# EAGLE schematic MIU60_REVE (EAGLE 6.5.0)
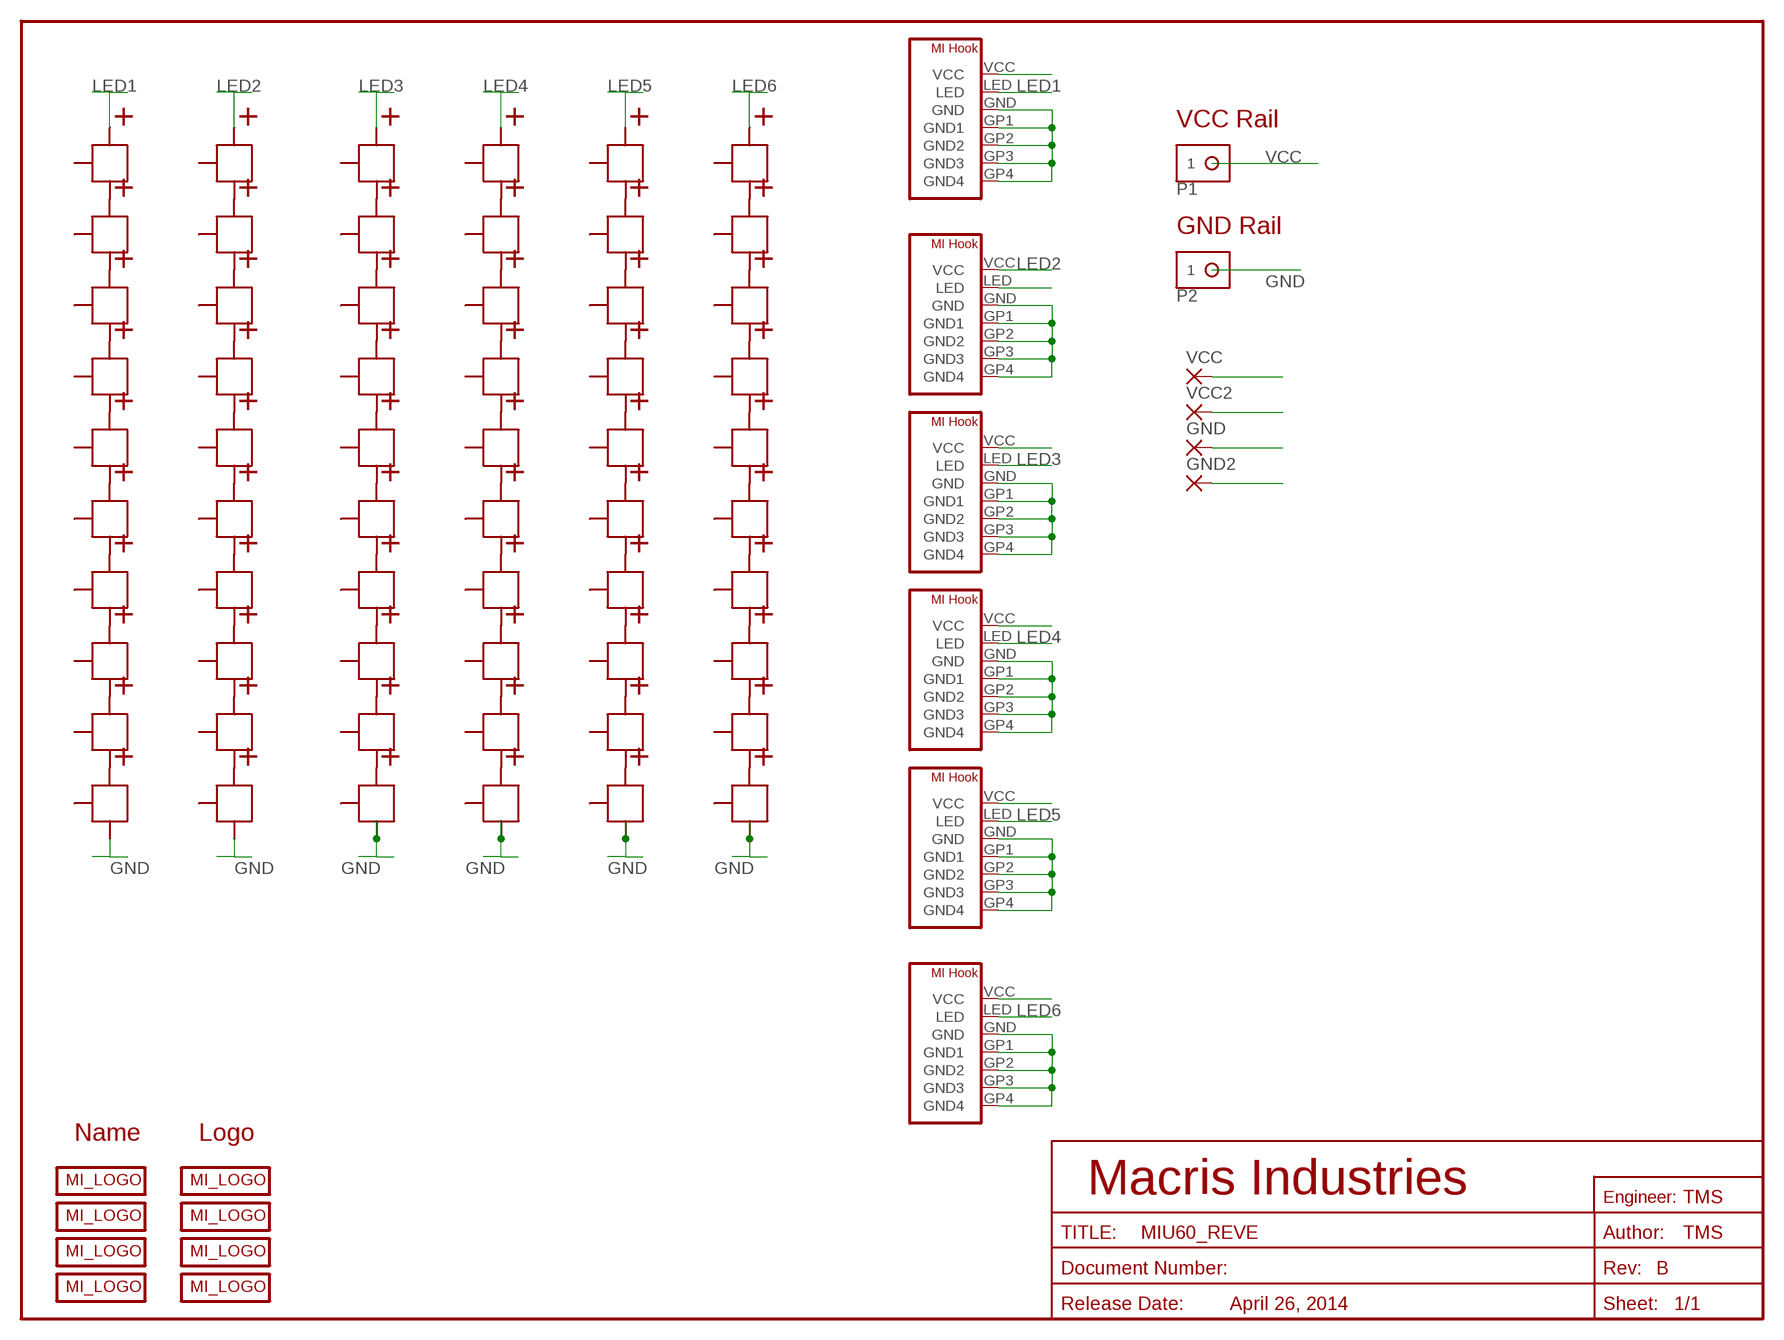
[diagram p0: schematic, sheet 1]

## Parts
GND  SMD5  [SMD2,54-5,08]
GND2  SMD5  [SMD2,54-5,08]
P1  PAD-10G  [PAD_10G]
P2  PAD-10G  [PAD_10G]
U$1  MI_LOGO-50MIL  MI_LOGO-NAME_TWO  [MI_LOGO_NAME_2]
U$2  MI_LOGO-2014_USA  [MACRIS_USA_LOGO]
U$3  MI_LOGO-50MIL  MI_LOGO-NAME_TWO  [MI_LOGO_NAME_2]
U$4  MI_LOGO-2014_USA  [MACRIS_USA_LOGO]
U$5  MI_LOGO-50MIL  MI_LOGO-NAME_TWO  [MI_LOGO_NAME_2]
U$6  MI_LOGO-50MIL  MI_LOGO-NAME_TWO  [MI_LOGO_NAME_2]
U$7  MI_LOGO-2014_USA  [MACRIS_USA_LOGO]
U$8  MI_LOGO-2014_USA  [MACRIS_USA_LOGO]
U$9  MI_DRIVER_HOOKUP  [MI_DRIVE_HOOKUP]
U$10  MI_DRIVER_HOOKUP  [MI_DRIVE_HOOKUP]
U$11  MI_DRIVER_HOOKUP  [MI_DRIVE_HOOKUP]
U$12  MI_DRIVER_HOOKUP  [MI_DRIVE_HOOKUP]
U$13  MI_DRIVER_HOOKUP  [MI_DRIVE_HOOKUP]
U$14  MI_DRIVER_HOOKUP  [MI_DRIVE_HOOKUP]
U$16  CREE_XP  [XP]
U$17  CREE_XP  [XP]
U$18  CREE_XP  [XP]
U$19  CREE_XP  [XP]
U$20  CREE_XP  [XP]
U$21  CREE_XP  [XP]
U$22  CREE_XP  [XP]
U$23  CREE_XP  [XP]
U$24  CREE_XP  [XP]
U$25  CREE_XP  [XP]
U$26  CREE_XP  [XP]
U$27  CREE_XP  [XP]
U$28  CREE_XP  [XP]
U$29  CREE_XP  [XP]
U$30  CREE_XP  [XP]
U$31  CREE_XP  [XP]
U$32  CREE_XP  [XP]
U$33  CREE_XP  [XP]
U$34  CREE_XP  [XP]
U$35  CREE_XP  [XP]
U$36  CREE_XP  [XP]
U$37  CREE_XP  [XP]
U$38  CREE_XP  [XP]
U$39  CREE_XP  [XP]
U$40  CREE_XP  [XP]
U$41  CREE_XP  [XP]
U$42  CREE_XP  [XP]
U$43  CREE_XP  [XP]
U$44  CREE_XP  [XP]
U$45  CREE_XP  [XP]
U$46  CREE_XP  [XP]
U$47  CREE_XP  [XP]
U$48  CREE_XP  [XP]
U$49  CREE_XP  [XP]
U$50  CREE_XP  [XP]
U$51  CREE_XP  [XP]
U$52  CREE_XP  [XP]
U$53  CREE_XP  [XP]
U$54  CREE_XP  [XP]
U$55  CREE_XP  [XP]
U$56  CREE_XP  [XP]
U$57  CREE_XP  [XP]
U$58  CREE_XP  [XP]
U$59  CREE_XP  [XP]
U$60  CREE_XP  [XP]
U$61  CREE_XP  [XP]
U$62  CREE_XP  [XP]
U$63  CREE_XP  [XP]
U$64  CREE_XP  [XP]
U$65  CREE_XP  [XP]
U$66  CREE_XP  [XP]
U$67  CREE_XP  [XP]
U$68  CREE_XP  [XP]
U$69  CREE_XP  [XP]
U$70  CREE_XP  [XP]
U$71  CREE_XP  [XP]
U$72  CREE_XP  [XP]
U$73  CREE_XP  [XP]
U$74  CREE_XP  [XP]
U$75  CREE_XP  [XP]
VCC  SMD5  [SMD2,54-5,08]
VCC2  SMD5  [SMD2,54-5,08]

## Nets
GND: GND2.1(P) GND.1(P) P2.1 U$9.GND U$9.GP1(GND1) U$9.GP2(GND2) U$9.GP3(GND3) U$9.GP4(GND4) U$10.GND U$10.GP1(GND1) U$10.GP2(GND2) U$10.GP3(GND3) U$10.GP4(GND4) U$11.GND U$11.GP1(GND1) U$11.GP2(GND2) U$11.GP3(GND3) U$11.GP4(GND4) U$12.GND U$12.GP1(GND1) U$12.GP2(GND2) U$12.GP3(GND3) U$12.GP4(GND4) U$13.GND U$13.GP1(GND1) U$13.GP2(GND2) U$13.GP3(GND3) U$13.GP4(GND4) U$14.GND U$14.GP1(GND1) U$14.GP2(GND2) U$14.GP3(GND3) U$14.GP4(GND4) U$25.NEGATIVE U$25.NEGATIVE1(NEGATIVE) U$35.NEGATIVE U$35.NEGATIVE1(NEGATIVE) U$45.NEGATIVE U$45.NEGATIVE1(NEGATIVE) U$55.NEGATIVE U$55.NEGATIVE1(NEGATIVE) U$65.NEGATIVE U$65.NEGATIVE1(NEGATIVE) U$75.NEGATIVE U$75.NEGATIVE1(NEGATIVE)
LED1: U$9.LED U$16.POSITIVE U$16.POSITIVE1(POSITIVE)
LED2: U$10.LED U$26.POSITIVE U$26.POSITIVE1(POSITIVE)
LED3: U$11.LED U$36.POSITIVE U$36.POSITIVE1(POSITIVE)
LED4: U$12.LED U$46.POSITIVE U$46.POSITIVE1(POSITIVE)
LED5: U$13.LED U$56.POSITIVE U$56.POSITIVE1(POSITIVE)
LED6: U$14.LED U$66.POSITIVE U$66.POSITIVE1(POSITIVE)
N$1: U$16.NEGATIVE U$16.NEGATIVE1(NEGATIVE) U$17.POSITIVE U$17.POSITIVE1(POSITIVE)
N$2: U$17.NEGATIVE U$17.NEGATIVE1(NEGATIVE) U$18.POSITIVE U$18.POSITIVE1(POSITIVE)
N$3: U$18.NEGATIVE U$18.NEGATIVE1(NEGATIVE) U$19.POSITIVE U$19.POSITIVE1(POSITIVE)
N$4: U$19.NEGATIVE U$19.NEGATIVE1(NEGATIVE) U$20.POSITIVE U$20.POSITIVE1(POSITIVE)
N$5: U$20.NEGATIVE U$20.NEGATIVE1(NEGATIVE) U$21.POSITIVE U$21.POSITIVE1(POSITIVE)
N$6: U$21.NEGATIVE U$21.NEGATIVE1(NEGATIVE) U$22.POSITIVE U$22.POSITIVE1(POSITIVE)
N$7: U$22.NEGATIVE U$22.NEGATIVE1(NEGATIVE) U$23.POSITIVE U$23.POSITIVE1(POSITIVE)
N$8: U$23.NEGATIVE U$23.NEGATIVE1(NEGATIVE) U$24.POSITIVE U$24.POSITIVE1(POSITIVE)
N$9: U$24.NEGATIVE U$24.NEGATIVE1(NEGATIVE) U$25.POSITIVE U$25.POSITIVE1(POSITIVE)
N$10: U$56.NEGATIVE U$56.NEGATIVE1(NEGATIVE) U$57.POSITIVE U$57.POSITIVE1(POSITIVE)
N$11: U$57.NEGATIVE U$57.NEGATIVE1(NEGATIVE) U$58.POSITIVE U$58.POSITIVE1(POSITIVE)
N$12: U$26.NEGATIVE U$26.NEGATIVE1(NEGATIVE) U$27.POSITIVE U$27.POSITIVE1(POSITIVE)
N$13: U$27.NEGATIVE U$27.NEGATIVE1(NEGATIVE) U$28.POSITIVE U$28.POSITIVE1(POSITIVE)
N$14: U$28.NEGATIVE U$28.NEGATIVE1(NEGATIVE) U$29.POSITIVE U$29.POSITIVE1(POSITIVE)
N$15: U$29.NEGATIVE U$29.NEGATIVE1(NEGATIVE) U$30.POSITIVE U$30.POSITIVE1(POSITIVE)
N$16: U$30.NEGATIVE U$30.NEGATIVE1(NEGATIVE) U$31.POSITIVE U$31.POSITIVE1(POSITIVE)
N$17: U$32.NEGATIVE U$32.NEGATIVE1(NEGATIVE) U$33.POSITIVE U$33.POSITIVE1(POSITIVE)
N$18: U$33.NEGATIVE U$33.NEGATIVE1(NEGATIVE) U$34.POSITIVE U$34.POSITIVE1(POSITIVE)
N$19: U$34.NEGATIVE U$34.NEGATIVE1(NEGATIVE) U$35.POSITIVE U$35.POSITIVE1(POSITIVE)
N$20: U$31.NEGATIVE U$31.NEGATIVE1(NEGATIVE) U$32.POSITIVE U$32.POSITIVE1(POSITIVE)
N$21: U$66.NEGATIVE U$66.NEGATIVE1(NEGATIVE) U$67.POSITIVE U$67.POSITIVE1(POSITIVE)
N$24: U$36.NEGATIVE U$36.NEGATIVE1(NEGATIVE) U$37.POSITIVE U$37.POSITIVE1(POSITIVE)
N$25: U$37.NEGATIVE U$37.NEGATIVE1(NEGATIVE) U$38.POSITIVE U$38.POSITIVE1(POSITIVE)
N$26: U$38.NEGATIVE U$38.NEGATIVE1(NEGATIVE) U$39.POSITIVE U$39.POSITIVE1(POSITIVE)
N$27: U$39.NEGATIVE U$39.NEGATIVE1(NEGATIVE) U$40.POSITIVE U$40.POSITIVE1(POSITIVE)
N$28: U$40.NEGATIVE U$40.NEGATIVE1(NEGATIVE) U$41.POSITIVE U$41.POSITIVE1(POSITIVE)
N$29: U$41.NEGATIVE U$41.NEGATIVE1(NEGATIVE) U$42.POSITIVE U$42.POSITIVE1(POSITIVE)
N$30: U$42.NEGATIVE U$42.NEGATIVE1(NEGATIVE) U$43.POSITIVE U$43.POSITIVE1(POSITIVE)
N$31: U$43.NEGATIVE U$43.NEGATIVE1(NEGATIVE) U$44.POSITIVE U$44.POSITIVE1(POSITIVE)
N$32: U$44.NEGATIVE U$44.NEGATIVE1(NEGATIVE) U$45.POSITIVE U$45.POSITIVE1(POSITIVE)
N$33: U$58.NEGATIVE U$58.NEGATIVE1(NEGATIVE) U$59.POSITIVE U$59.POSITIVE1(POSITIVE)
N$34: U$59.NEGATIVE U$59.NEGATIVE1(NEGATIVE) U$60.POSITIVE U$60.POSITIVE1(POSITIVE)
N$35: U$67.NEGATIVE U$67.NEGATIVE1(NEGATIVE) U$68.POSITIVE U$68.POSITIVE1(POSITIVE)
N$36: U$46.NEGATIVE U$46.NEGATIVE1(NEGATIVE) U$47.POSITIVE U$47.POSITIVE1(POSITIVE)
N$37: U$47.NEGATIVE U$47.NEGATIVE1(NEGATIVE) U$48.POSITIVE U$48.POSITIVE1(POSITIVE)
N$38: U$48.NEGATIVE U$48.NEGATIVE1(NEGATIVE) U$49.POSITIVE U$49.POSITIVE1(POSITIVE)
N$39: U$49.NEGATIVE U$49.NEGATIVE1(NEGATIVE) U$50.POSITIVE U$50.POSITIVE1(POSITIVE)
N$40: U$50.NEGATIVE U$50.NEGATIVE1(NEGATIVE) U$51.POSITIVE U$51.POSITIVE1(POSITIVE)
N$41: U$51.NEGATIVE U$51.NEGATIVE1(NEGATIVE) U$52.POSITIVE U$52.POSITIVE1(POSITIVE)
N$42: U$52.NEGATIVE U$52.NEGATIVE1(NEGATIVE) U$53.POSITIVE U$53.POSITIVE1(POSITIVE)
N$43: U$53.NEGATIVE U$53.NEGATIVE1(NEGATIVE) U$54.POSITIVE U$54.POSITIVE1(POSITIVE)
N$44: U$68.NEGATIVE U$68.NEGATIVE1(NEGATIVE) U$69.POSITIVE U$69.POSITIVE1(POSITIVE)
N$46: U$54.NEGATIVE U$54.NEGATIVE1(NEGATIVE) U$55.POSITIVE U$55.POSITIVE1(POSITIVE)
N$47: U$60.NEGATIVE U$60.NEGATIVE1(NEGATIVE) U$61.POSITIVE U$61.POSITIVE1(POSITIVE)
N$48: U$61.NEGATIVE U$61.NEGATIVE1(NEGATIVE) U$62.POSITIVE U$62.POSITIVE1(POSITIVE)
N$49: U$62.NEGATIVE U$62.NEGATIVE1(NEGATIVE) U$63.POSITIVE U$63.POSITIVE1(POSITIVE)
N$50: U$63.NEGATIVE U$63.NEGATIVE1(NEGATIVE) U$64.POSITIVE U$64.POSITIVE1(POSITIVE)
N$51: U$64.NEGATIVE U$64.NEGATIVE1(NEGATIVE) U$65.POSITIVE U$65.POSITIVE1(POSITIVE)
N$52: U$69.NEGATIVE U$69.NEGATIVE1(NEGATIVE) U$70.POSITIVE U$70.POSITIVE1(POSITIVE)
N$53: U$70.NEGATIVE U$70.NEGATIVE1(NEGATIVE) U$71.POSITIVE U$71.POSITIVE1(POSITIVE)
N$54: U$71.NEGATIVE U$71.NEGATIVE1(NEGATIVE) U$72.POSITIVE U$72.POSITIVE1(POSITIVE)
N$55: U$72.NEGATIVE U$72.NEGATIVE1(NEGATIVE) U$73.POSITIVE U$73.POSITIVE1(POSITIVE)
N$56: U$73.NEGATIVE U$73.NEGATIVE1(NEGATIVE) U$74.POSITIVE U$74.POSITIVE1(POSITIVE)
N$57: U$74.NEGATIVE U$74.NEGATIVE1(NEGATIVE) U$75.POSITIVE U$75.POSITIVE1(POSITIVE)
VCC: P1.1 U$9.VCC U$10.VCC U$11.VCC U$12.VCC U$13.VCC U$14.VCC VCC2.1(P) VCC.1(P)
Unconnected: U$16.THERMAL U$17.THERMAL U$18.THERMAL U$19.THERMAL U$20.THERMAL U$21.THERMAL U$22.THERMAL U$23.THERMAL U$24.THERMAL U$25.THERMAL U$26.THERMAL U$27.THERMAL U$28.THERMAL U$29.THERMAL U$30.THERMAL U$31.THERMAL U$32.THERMAL U$33.THERMAL U$34.THERMAL U$35.THERMAL U$36.THERMAL U$37.THERMAL U$38.THERMAL U$39.THERMAL U$40.THERMAL U$41.THERMAL U$42.THERMAL U$43.THERMAL U$44.THERMAL U$45.THERMAL U$46.THERMAL U$47.THERMAL U$48.THERMAL U$49.THERMAL U$50.THERMAL U$51.THERMAL U$52.THERMAL U$53.THERMAL U$54.THERMAL U$55.THERMAL U$56.THERMAL U$57.THERMAL U$58.THERMAL U$59.THERMAL U$60.THERMAL U$61.THERMAL U$62.THERMAL U$63.THERMAL U$64.THERMAL U$65.THERMAL U$66.THERMAL U$67.THERMAL U$68.THERMAL U$69.THERMAL U$70.THERMAL U$71.THERMAL U$72.THERMAL U$73.THERMAL U$74.THERMAL U$75.THERMAL

## Notes on the sheet
- VCC Rail
- GND Rail
- Name | Logo
- Macris Industries
- TMS
- TMS
- B
- April 26, 2014

## Library data of the parts
GND GND2 VCC VCC2 = wirepad:SMD5: SMD PAD
P1 P2 = Mechanical:PAD: Solder Pads
U$1-U$8 = Logo:MI_LOGO
U$9-U$14 = Mechanical:MI_DRIVER_HOOKUP
U$16-U$75 = Cree_XP:CREE_XP